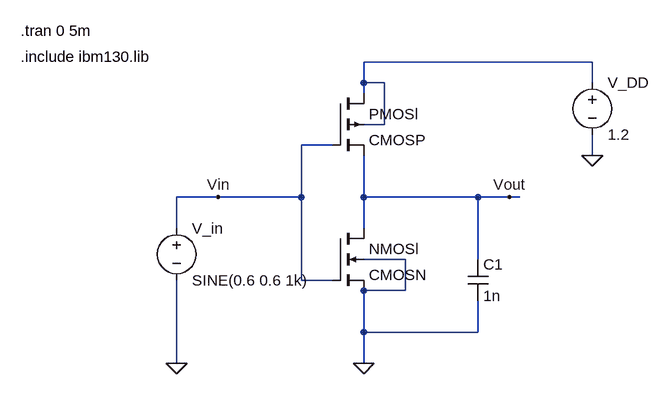
[diagram p0: schematic sim5.5.asc]
sim5.5.asc, the LTspice schematic file:
Version 4
SHEET 1 1300 680
WIRE 848 0 496 0
WIRE 496 32 496 0
WIRE 528 32 496 32
WIRE 848 32 848 0
WIRE 496 48 496 32
WIRE 528 96 528 32
WIRE 528 96 496 96
WIRE 448 128 400 128
WIRE 848 144 848 112
WIRE 272 208 208 208
WIRE 400 208 400 128
WIRE 400 208 272 208
WIRE 496 208 496 144
WIRE 672 208 496 208
WIRE 720 208 672 208
WIRE 736 208 720 208
WIRE 208 256 208 208
WIRE 496 256 496 208
WIRE 560 304 496 304
WIRE 672 304 672 208
WIRE 400 336 400 208
WIRE 448 336 400 336
WIRE 560 352 560 304
WIRE 560 352 496 352
WIRE 496 416 496 352
WIRE 672 416 672 368
WIRE 672 416 496 416
WIRE 208 464 208 336
WIRE 496 464 496 416
FLAG 496 464 0
FLAG 208 464 0
FLAG 848 144 0
FLAG 720 208 Vout
FLAG 272 208 Vin
SYMBOL CMOSN 448 256 R0
SYMATTR InstName NMOSl
SYMATTR Value2 l=100n w=100n
SYMBOL voltage 208 240 R0
SYMATTR InstName V_in
SYMATTR Value SINE(0.6 0.6 1k)
SYMBOL voltage 848 16 R0
SYMATTR InstName V_DD
SYMATTR Value 1.2
SYMBOL cap 656 304 R0
SYMATTR InstName C1
SYMATTR Value 1n
SYMBOL CMOSP 448 48 R0
SYMATTR InstName PMOSl
SYMATTR Value2 l=100n w=200n
TEXT -32 -48 Left 2 !.tran 0 5m
TEXT -32 -8 Left 2 !.include ibm130.lib

The netlist it stands for:
* sim5.5.asc
M§NMOSl Vout Vin 0 0 CMOSN l=100n w=100n
V_in Vin 0 SINE(0.6 0.6 1k)
V_DD N001 0 1.2
C1 Vout 0 1n
M§PMOSl N001 Vin Vout N001 CMOSP l=100n w=200n
.model NMOS NMOS
.model PMOS PMOS
.lib standard.mos
.tran 0 5m
.include ibm130.lib
.backanno
.end